# EAGLE design JN5168_Breakout (EAGLE 7.5.0)
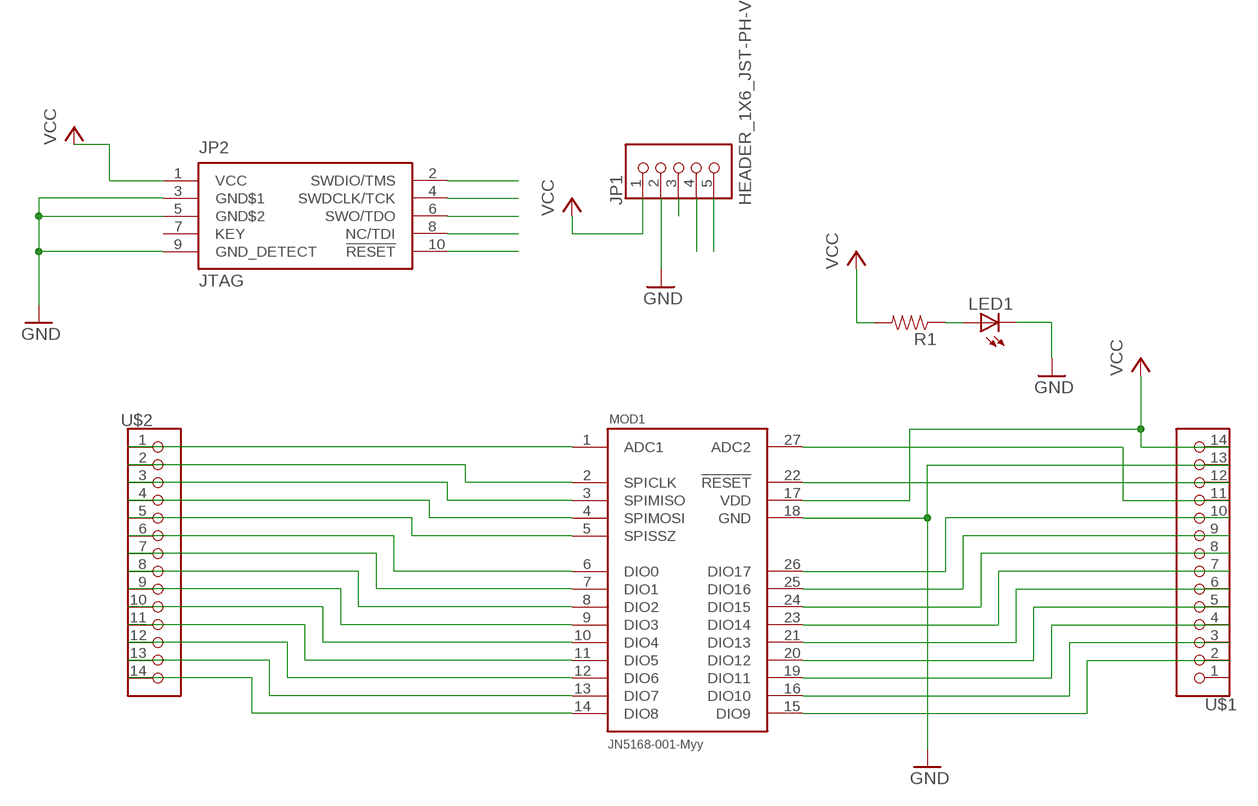
[diagram p0: schematic, sheet 1]

## Parts
JP1  HEADER_1X6_JST-PH-V  HEADER_1X5100MIL_PTH  [HEADER_100MIL_1X5]
JP2  JTAG_HEADER  [HEADER_50MIL_2X5_PTH]
LED1  LEDCHIPLED_0603  [CHIPLED_0603]
MOD1  JN5168-001-M00  [JN5168-001-M00]
R1  R0603  [R0603]
U$1  HEADER_1X14_100MIL_PTH  [HEADER_100MIL_1X14_PTH]
U$2  HEADER_1X14_100MIL_PTH  [HEADER_100MIL_1X14_PTH]

## Nets
!RESET: JP1.3 JP2.10(!RESET) MOD1.22(!RESET) U$1.12
ADC1: MOD1.1(ADC1) U$2.1
ADC2: MOD1.27(ADC2) U$1.11
GND: JP1.2 JP2.3(GND$1) JP2.5(GND$2) JP2.9(GND_DETECT) LED1.C MOD1.18(GND) U$1.13
GPIO0: MOD1.6(DIO0) U$2.6
GPIO1: MOD1.7(DIO1) U$2.7
GPIO2: MOD1.8(DIO2) U$2.8
GPIO3: MOD1.9(DIO3) U$2.9
GPIO4/JTAG_TCK: JP2.4(SWDCLK/TCK) MOD1.10(DIO4) U$2.10
GPIO5/JTAG_TMS: JP2.2(SWDIO/TMS) MOD1.11(DIO5) U$2.11
GPIO6/TXD0/JTAG_TDO: JP1.4 JP2.6(SWO/TDO) MOD1.12(DIO6) U$2.12
GPIO7/RXD0/JTAG_TDI: JP1.5 JP2.8(NC/TDI) MOD1.13(DIO7) U$2.13
GPIO8: MOD1.14(DIO8) U$2.14
GPIO9: MOD1.15(DIO9) U$1.2
GPIO10: MOD1.16(DIO10) U$1.3
GPIO11: MOD1.19(DIO11) U$1.4
GPIO12/JTAG_TCK: MOD1.20(DIO12) U$1.5
GPIO13/JTAG_TMS: MOD1.21(DIO13) U$1.6
GPIO14/JTAG_TD0: MOD1.23(DIO14) U$1.7
GPIO15/JTAG_TDI: MOD1.24(DIO15) U$1.8
GPIO16: MOD1.25(DIO16) U$1.9
GPIO17: MOD1.26(DIO17) U$1.10
N$18: LED1.A R1.1
SPICLK: MOD1.2(SPICLK) U$2.2
SPIMISO: MOD1.3(SPIMISO) U$2.3
SPIMOSI: MOD1.4(SPIMOSI) U$2.4
SPISSZ: MOD1.5(SPISSZ) U$2.5
VCC: JP1.1 JP2.1(VCC) MOD1.17(VDD) R1.2 U$1.14
Unconnected: JP2.7(KEY) U$1.1

## Library data of the parts
JP1 = heck:HEADER_1X5
JP2 = heck:JTAG_HEADER
LED1 = adafruit:LED: LED OSRAM: - CHIPLED LG R971, LG N971, LY N971, LG Q971, LY Q971, LO R971, LY R971 LH N974, LH R974 LS Q976, LO Q976, LY Q976 LO Q996 - Hyper CHIPLED LW Q18S LB Q993, LB Q99A, LB R99A - SideLED LS A670, LO A670, LY A670, LG A670, LP A670 LB A673, LV A673, LT A673, LW A673 LH A674 LY A675 LS A676, LA A676, LO A676, LY A676, LW A676 LS A679, LY A679, LG A679 - Hyper Micro SIDELED® LS Y876, LA Y876, LO Y876, LY Y876 LT Y87S - SmartLED LW L88C, LW L88S LB L89C, LB L89S, LG L890 LS L89K, LO L89K, LY L89K LS L896, LA L896, LO L896, LY L896 - TOPLED LS T670, LO T670, LY T670, LG T670, LP T670 LSG T670, LSP T670, LSY T670, LOP T670, LYG T670 LG T671, LOG T671, LSG T671 LB T673, LV T673, LT T673, LW T673 LH T674 LS T676, LA T676, LO T676, LY T676, LB T676, LH T676, LSB T676, LW T676 LB T67C, LV T67C, LT T67C, LS T67K, LO T67K, LY T67K, LW E67C LS E67B, LA E67B, LO E67B, LY E67B, LB E67C, LV E67C, LT E67C LW T67C LS T679, LY T679, LG T679 LS T770, LO T770, LY T770, LG T770, LP T770 LB T773, LV T773, LT T773, LW T773 LH T774 LS E675, LA E675, LY E675, LS T675 LS T776, LA T776, LO T776, LY T776, LB T776 LHGB T686 LT T68C, LB T68C - Hyper Mini TOPLED® LB M676 - Mini TOPLED Santana® LG M470 LS M47K, LO M47K, LY M47K Source: http://www.osram.convergy.de/
MOD1 = heck:JN5168-001-M: The JN5168-001-Myy family is a range of ultra low power, high performance surface mount modules targeted at IEEE 802.15.4, JenNet-IP, ZigBee Light Link, ZigBee Smart Energy and RF4CE networking applications, enabling users to realise products with minimum time to market and at the lowest cost. They remove the need for expensive and lengthy development of custom RF board designs and test suites. The modules use NXP’s JN5168 wireless microcontroller to provide a comprehensive solution with large memory, high CPU and radio performance and all RF components included. All that is required to develop and manufacture wireless control or sensing products is to connect a power supply and peripherals such as switches, actuators and sensors, considerably simplifying product development. Four module variants are available: JN5168-001-M00 with an integrated antenna, JN5168-001-M03 with an antenna connector and the JN5168-001-M05 and M06 with an antenna connector, power amplifier and LNA for extended range. The JN5168-001-M05 output power has been optimised for use in Europe and Asia.
R1 = heck:R
U$1 U$2 = heck:HEADER_1X14

## Board
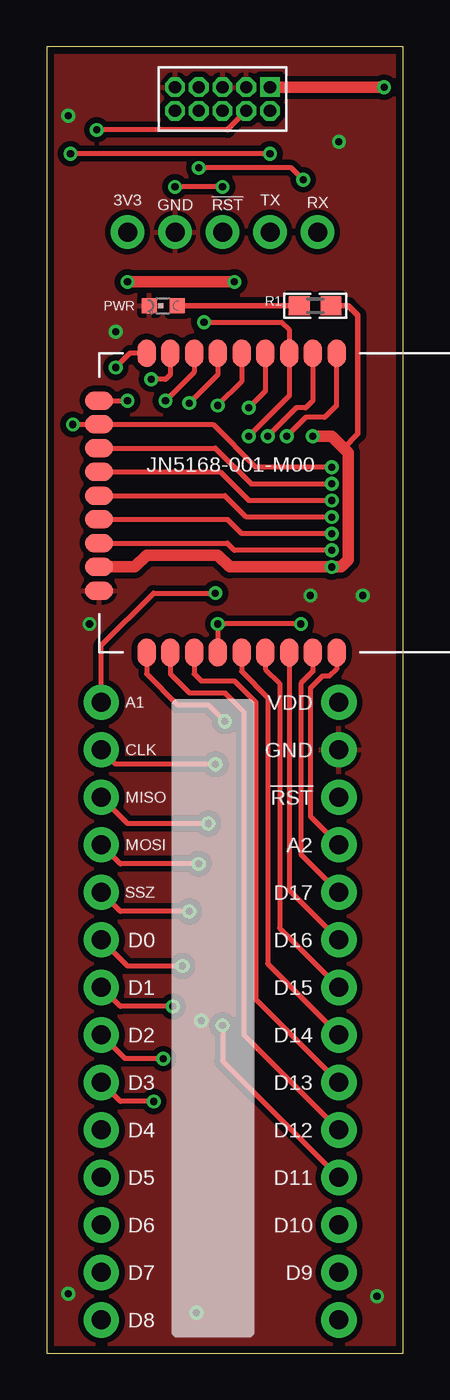
[diagram p1: board, top side]
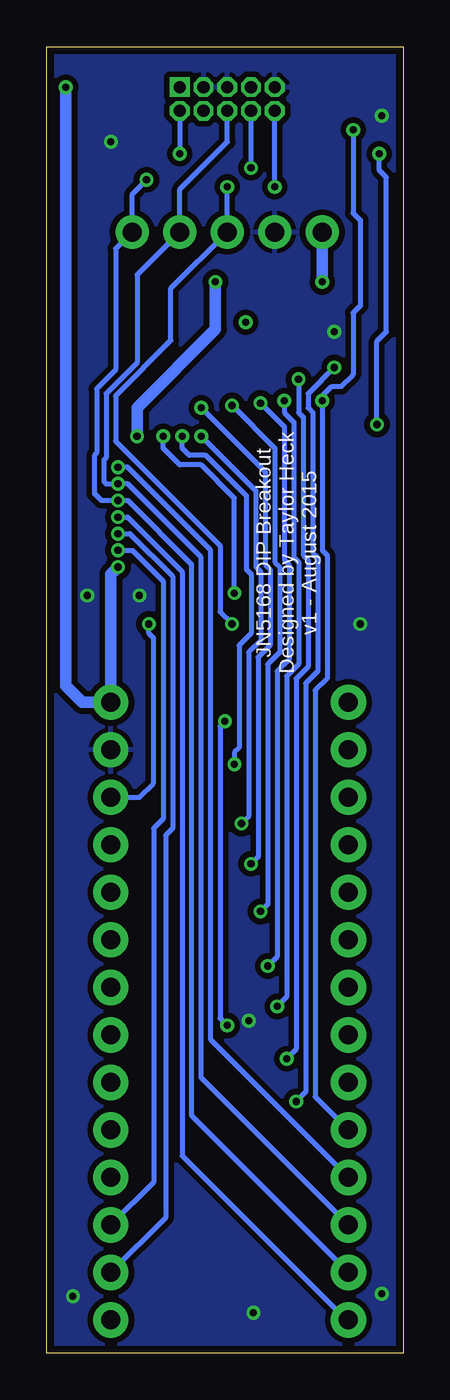
[diagram p2: board, bottom side, seen from below]

Size 19.05 x 69.85 mm. Coordinates in mm from the lower left corner, seen from the top.
Outline: 0,0 19.05,0 19.05,69.85 0,69.85 0,0
Copper layers (1*16): Top 0.0356mm / dielectric 1.5011mm / Bottom 0.0356mm
Design rules "heck *": minimum track width 6mil, minimum drill 13mil, track to track 6mil, track to pad 6mil, pad to pad 6mil, via to via 6mil, smd to smd 6mil, copper to edge 15mil, drill to drill 6mil, minimum pad ring 7mil, minimum via ring 7mil, stop-mask expansion 3mil, vias tented up to drill 20mil, thermal gap 10mil

### Footprints (pad centres in the part's own frame; a part is rotated, then mirrored left to right if it is on the bottom)
HEADER_100MIL_1X5 = drill 1.016 pad 1.778: 1 -5.08,0; 2 -2.54,0; 3 0,0; 4 2.54,0; 5 5.08,0
HEADER_50MIL_2X5_PTH = drill 0.65 pad 1.05 square: 1 -2.54,-0.635 | drill 0.65 pad 1.05 octagon: 2 -2.54,0.635; 3 -1.27,-0.635; 4 -1.27,0.635; 5 0,-0.635; 6 0,0.635; 7 1.27,-0.635; 8 1.27,0.635; 9 2.54,-0.635; 10 2.54,0.635
CHIPLED_0603 = smd 0.8 x 0.8: A 0,-0.75; C 0,0.75
JN5168-001-M00 = smd 1.5 x 1: 1 -7.62,10.16; 2 -7.62,8.89; 3 -7.62,7.62; 4 -7.62,6.35; 5 -7.62,5.08; 6 -7.62,3.81; 7 -7.62,2.54; 8 -7.62,1.27; 9 -7.62,0; 19 8.38,0; 20 8.38,1.27; 21 8.38,2.54; 22 8.38,3.81; 23 8.38,5.08; 24 8.38,6.35; 25 8.38,7.62; 26 8.38,8.89; 27 8.38,10.16 | smd 1 x 1.5: 10 -5.08,-2.54; 11 -3.81,-2.54; 12 -2.54,-2.54; 13 -1.27,-2.54; 14 0,-2.54; 15 1.27,-2.54; 16 2.54,-2.54; 17 3.81,-2.54; 18 5.08,-2.54
R0603 = smd 1.1 x 1: 1 -0.85,0; 2 0.85,0
HEADER_100MIL_1X14_PTH = drill 1.016 pad 1.88: 1 -16.51,0; 2 -13.97,0; 3 -11.43,0; 4 -8.89,0; 5 -6.35,0; 6 -3.81,0; 7 -1.27,0; 8 1.27,0; 9 3.81,0; 10 6.35,0; 11 8.89,0; 12 11.43,0; 13 13.97,0; 14 16.51,0

### Placement (x,y rotation side)
JP1  9.4,59.94 0 top
JP2  9.4,67.06 180 top
LED1  6.22,56.01 90 top
MOD1  5.33,45.85 270 top
R1  14.35,56.01 0 top
U$1  15.62,18.29 90 top
U$2  2.92,18.29 270 top

### Tracks (layer width: path | path; a pad name or v marks a point on that pad's centre or on a via)
!RESET  (via drill 0.38)
  Top 0.254: v13.59,38.99 v9.14,38.99 MOD1.22 | v9.4,62.36 v6.86,62.36
  Bottom 0.254: U$1.12 14.1,29.72 13.34,30.48 13.34,38.23 13.59,38.48 v13.59,38.99 | v9.14,38.99 9.78,39.62 9.78,43.18 15.37,48.77 15.37,51.19 12.41,54.15 12.41,56.93 JP1.3 v9.4,62.36 | v6.86,62.36 JP2.10
ADC1  (via drill 0.38)
  Top 0.254: U$2.1 2.92,37.85 5.71,40.64 v9.02,40.64 | MOD1.1 15.49,50.67 14.86,50.04 13.84,50.04 v12.83,49.02
  Bottom 0.254: v9.02,40.64 9.02,45.72 10.79,47.5 11.94,47.5 12.83,48.39 v12.83,49.02
ADC2
  Top 0.254: MOD1.27 15.49,36.58 15.11,36.2 14.73,36.2 14.1,35.56 14.1,28.7 U$1.11
GND  (via drill 0.38)
  other vias: 2.29,38.99 14.1,40.51 8,2.16 8.26,17.78 3.68,54.61 16.89,40.51 15.62,64.77 1.14,66.17 17.65,3.05 1.14,3.17
  pour Bottom (isolate 0.305, rank 5): 0,0 19.05,0 19.05,69.85 -0.13,69.85
  pour Top (isolate 0.305, rank 5): -0.13,69.85 0,0 19.05,0 19.05,69.85
GPIO0  (via drill 0.38)
  Top 0.254: MOD1.6 9.14,52.32 v7.62,50.8 | v7.24,20.7 4.32,20.7 U$2.6
  Bottom 0.254: v7.62,50.8 6.35,49.53 6.35,42.42 6.1,42.16 6.1,37.08 6.73,36.45 6.73,21.21 v7.24,20.7
GPIO1  (via drill 0.38)
  Top 0.254: MOD1.7 7.87,52.45 v6.35,50.93 | v6.73,18.54 3.94,18.54 U$2.7
  Bottom 0.254: v6.35,50.93 6.35,50.29 5.84,49.78 5.84,42.55 5.59,42.29 5.59,36.83 6.22,36.2 6.22,19.05 v6.73,18.54
GPIO2  (via drill 0.38)
  Top 0.254: MOD1.8 6.6,52.32 6.35,52.07 v5.59,52.07 | v6.22,15.75 4.19,15.75 U$2.8
  Bottom 0.254: v5.59,52.07 5.59,50.29 5.33,50.04 5.33,42.67 5.08,42.42 5.08,36.7 5.71,36.07 5.71,16.26 v6.22,15.75
GPIO3  (via drill 0.38)
  Top 0.254: MOD1.9 4.45,53.47 v3.68,52.7 | v5.71,13.46 3.94,13.46 U$2.9
  Bottom 0.254: v3.68,52.7 5.08,51.31 5.08,50.55 4.83,50.29 4.83,42.8 4.57,42.55 4.57,36.45 5.21,35.81 5.21,13.97 v5.71,13.46
GPIO4/JTAG_TCK  (via drill 0.38)
  Top 0.254: MOD1.10 v4.32,50.93 | JP2.4 9.65,65.41 v2.67,65.41
  Bottom 0.254: U$2.10 4.7,13.72 4.7,35.43 4.06,36.07 4.06,42.67 4.32,42.93 v4.32,50.93 4.32,51.18 3.81,51.69 3.3,51.69 2.67,52.32 2.67,55.63 2.29,56.01 2.29,60.58 2.67,60.96 v2.67,65.41
GPIO5/JTAG_TMS  (via drill 0.38)
  Top 0.254: MOD1.11 8.89,49.66 11.18,47.37 v15.24,47.37 | 2.54,49.66 MOD1.11 | v1.4,49.66 MOD1.11 | v11.94,64.14 v1.27,64.14
  Bottom 0.254: U$2.11 10.29,16.76 10.29,42.93 14.73,47.37 v15.24,47.37 | JP2.2 v11.94,64.14 | v1.4,49.66 1.4,54.1 0.89,54.61 0.89,62.87 1.27,63.25 v1.27,64.14
GPIO6/TXD0/JTAG_TDO  (via drill 0.38)
  Top 0.254: MOD1.12 9.02,48.39 10.92,46.48 v15.24,46.48
  Bottom 0.254: U$2.12 10.79,14.73 10.79,42.55 14.73,46.48 v15.24,46.48 15.88,46.48 16,46.61 16,47.75 15.88,47.88 15.88,51.31 14.22,52.96 14.22,57.66 JP1.4 11.94,62.23 9.4,64.77 JP2.6
GPIO7/RXD0/JTAG_TDI  (via drill 0.38)
  Top 0.254: MOD1.13 9.27,47.12 10.79,45.59 v15.24,45.59 | v13.72,62.74 13.08,63.37 v8.13,63.37
  Bottom 0.254: U$2.13 11.3,12.7 11.3,42.16 14.73,45.59 v15.24,45.59 16.13,45.59 16.51,45.97 16.51,48.01 16.38,48.13 16.38,51.56 15.37,52.58 15.37,59.05 JP1.5 14.48,61.98 v13.72,62.74 | v8.13,63.37 JP2.8
GPIO8  (via drill 0.38)
  Top 0.254: MOD1.14 9.53,45.85 10.67,44.7 v15.24,44.7
  Bottom 0.254: v15.24,44.7 14.73,44.7 11.81,41.78 11.81,10.56 3.03,1.78 U$2.14
GPIO9  (via drill 0.38)
  Top 0.254: MOD1.15 9.65,44.58 10.41,43.81 v15.24,43.81
  Bottom 0.254: U$1.2 12.7,7.24 12.7,27.69 12.32,28.07 12.32,41.53 14.61,43.81 v15.24,43.81
GPIO10  (via drill 0.38)
  Top 0.254: MOD1.16 9.65,43.31 10.03,42.93 v15.24,42.93
  Bottom 0.254: U$1.3 13.34,9.14 13.34,28.07 12.83,28.57 12.83,41.27 14.48,42.93 v15.24,42.93
GPIO11  (via drill 0.38)
  Top 0.254: MOD1.19 5.33,36.32 6.99,34.67 8.64,34.67 v9.53,33.78 | U$1.4 9.4,15.62 v9.4,17.53
  Bottom 0.254: v9.53,33.78 9.78,33.53 9.78,17.91 v9.4,17.53
GPIO12/JTAG_TCK
  Top 0.254: MOD1.20 6.6,36.32 7.62,35.31 9.53,35.31 10.54,34.29 10.54,17.02 U$1.5
GPIO13/JTAG_TMS
  Top 0.254: MOD1.21 7.87,36.32 8.26,35.94 10.03,35.94 11.18,34.8 11.18,18.92 U$1.6
GPIO14/JTAG_TD0
  Top 0.254: MOD1.23 10.41,36.45 11.81,35.05 11.81,20.83 U$1.7
GPIO15/JTAG_TDI
  Top 0.254: MOD1.24 11.68,36.58 12.45,35.81 12.45,22.73 U$1.8
GPIO16
  Top 0.254: MOD1.25 12.95,24.77 U$1.9
GPIO17
  Top 0.254: MOD1.26 14.22,36.45 13.59,35.81 13.59,26.67 U$1.10
N$18
  Top 0.305: R1.1 LED1.A
SPICLK  (via drill 0.38)
  Top 0.254: MOD1.2 14.22,50.93 13.84,50.55 13.34,50.55 v11.81,49.02 | v9.02,31.5 3.68,31.5 U$2.2
  Bottom 0.254: v9.02,31.5 9.02,32.13 8.76,32.38 8.76,37.85 8.13,38.48 8.13,41.66 8.38,41.91 8.38,45.85 10.54,48.01 11.43,48.01 11.81,48.39 v11.81,49.02
SPIMISO  (via drill 0.38)
  Top 0.254: v10.79,49.02 12.95,51.18 MOD1.3 12.95,54.74 12.57,55.12 v8.41,55.12 | v8.64,28.32 4.32,28.32 U$2.3
  Bottom 0.254: v10.79,49.02 7.87,46.1 7.87,42.04 7.62,41.78 7.62,38.1 8.26,37.47 8.26,28.7 v8.64,28.32
SPIMOSI  (via drill 0.38)
  Top 0.254: MOD1.4 11.68,51.44 v10.79,50.55 | v8.13,26.16 3.94,26.16 U$2.4
  Bottom 0.254: v10.79,50.55 7.37,47.12 7.37,42.16 7.11,41.91 7.11,37.85 7.75,37.21 7.75,26.54 v8.13,26.16
SPISSZ  (via drill 0.38)
  Top 0.254: MOD1.5 10.41,51.94 v9.14,50.67 | v7.62,23.62 3.94,23.62 U$2.5
  Bottom 0.254: v9.14,50.67 6.86,48.39 6.86,42.29 6.6,42.04 6.6,37.47 7.24,36.83 7.24,24 v7.62,23.62
VCC  (via drill 0.38)
  Top 0.305: R1.2 16.13,56.01 16.64,55.5 16.64,49.15 15.88,48.39
  Top 0.61: v14.22,49.02 15.24,49.02 15.88,48.39 16.13,48.13 16.13,42.42 15.75,42.04 v15.24,42.04 9.78,42.04 9.14,42.67 5.33,42.67 4.7,42.04 MOD1.17 | JP2.1 v18.03,67.69 | v10.03,57.28 v4.32,57.28
  Bottom 0.61: v15.24,42.04 15.62,41.66 U$1.14 17.14,34.8 18.03,35.69 v18.03,67.69 | v14.22,49.02 14.22,50.56 10.03,54.75 v10.03,57.28 | v4.32,57.28 JP1.1

### Text on the board
tPlace: 3V3 | GND | !RST | TX | RX | A1 | VDD | CLK | GND | MISO | !RST | MOSI | A2 | SSZ | D17 | D0 | D16 | D1 | D15 | D2 | D14 | D3 | D13 | D4 | D12 | D5 | D11 | D6 | D10 | D7 | D9 | D8
bPlace: JN5168 DIP Breakout / Designed by Taylor Heck / v1 - August 2015
tNames: PWR